# EAGLE schematic Communication (EAGLE 8.3.2)
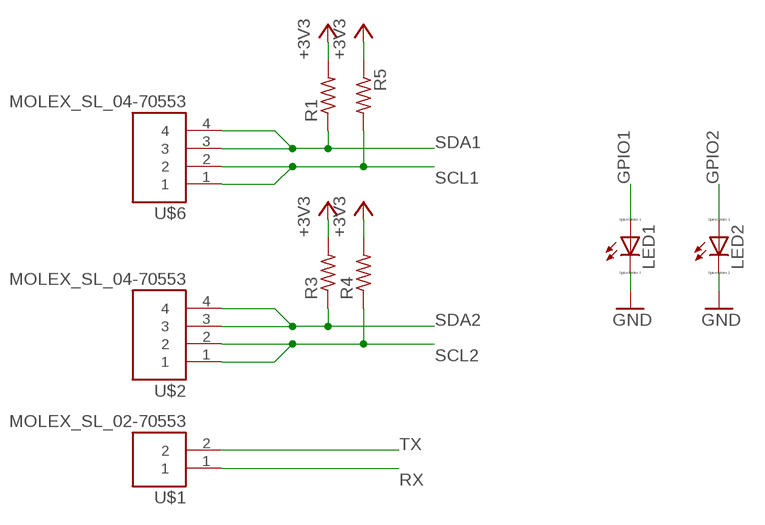
[diagram p0: schematic, sheet 1]

## Parts
LED1  LED_E  [LED_1206]
LED2  LED_E  [LED_1206]
R1  R-US_M1206  [M1206]
R3  R-US_M1206  [M1206]
R4  R-US_M1206  [M1206]
R5  R-US_M1206  [M1206]
U$1  MOLEX_SL_02-70553  [SL_70553_2]
U$2  MOLEX_SL_04-70553  [SL_70553_4]
U$6  MOLEX_SL_04-70553  [SL_70553_4]

## Nets
+3V3: R1.2 R3.2 R4.2 R5.1
GND: LED1.C LED2.C
GPIO1: LED1.A
GPIO2: LED2.A
RX: U$1.1
SCL1: R5.2 U$6.1 U$6.2
SCL2: R4.1 U$2.1 U$2.2
SDA1: R1.1 U$6.3 U$6.4
SDA2: R3.1 U$2.3 U$2.4
TX: U$1.2

## Library data of the parts
LED1 LED2 = eagle-ltspice:LED_E: LED Source: http://www.osram.convergy.de Source: www.luxeon.com Source: www.kingbright.com; SPICEMODEL: NONE; SPICEPREFIX: D; SPICETYPE: diode
R1 R3-R5 = resistor:R-US_: RESISTOR, American symbol
U$1 = molex-sl-connectors_jw:MOLEX_SL_02: Molex SL-Series PCB Header, 2-Pos, 0.1" (2.54mm) Centers
U$2 U$6 = molex-sl-connectors_jw:MOLEX_SL_04: Molex SL-Series PCB Header, 4-Pos, 0.1" (2.54mm) Centers